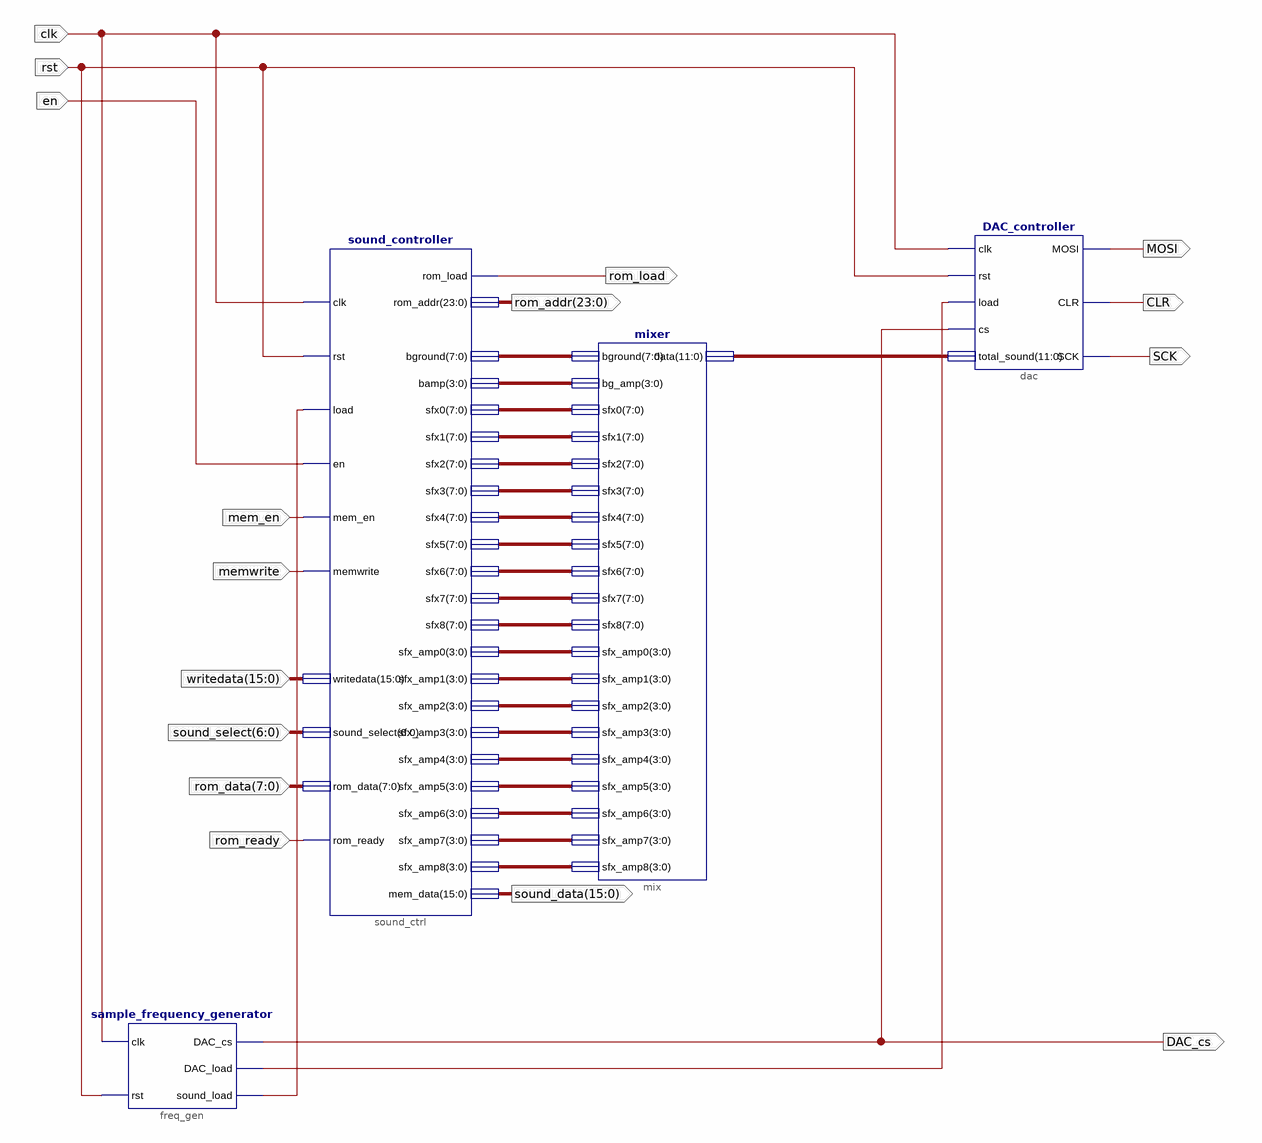
[diagram p0: schematic sheet 1]
// Xilinx ISE schematic sound_schematic.sch (spartan3e) as structural Verilog: 4 symbols, 16 ports
module sound_schematic (
  input  [15:0] writedata,
  input  [6:0] sound_select,
  input  mem_en,
  input  memwrite,
  input  rst,
  input  en,
  input  clk,
  input  [7:0] rom_data,
  input  rom_ready,
  output MOSI,
  output SCK,
  output DAC_cs,
  output [15:0] sound_data,
  output rom_load,
  output [23:0] rom_addr,
  output CLR
);

  wire XLXN_149, XLXN_150;
  wire [3:0] XLXN_2, XLXN_12, XLXN_13, XLXN_14, XLXN_15, XLXN_16, XLXN_17, XLXN_18, XLXN_19, XLXN_20;
  wire [7:0] XLXN_1, XLXN_3, XLXN_4, XLXN_5, XLXN_6, XLXN_7, XLXN_8, XLXN_9, XLXN_10, XLXN_11;
  wire [11:0] XLXN_21;

  sound_controller sound_ctrl (
    .clk(clk), .rst(rst), .load(XLXN_149), .en(en), .mem_en(mem_en), .memwrite(memwrite),
    .writedata(writedata), .sound_select(sound_select), .rom_data(rom_data), .bground(XLXN_1), .bamp(XLXN_2),
    .sfx0(XLXN_3), .sfx1(XLXN_4), .sfx2(XLXN_5), .sfx3(XLXN_6), .sfx4(XLXN_7), .sfx5(XLXN_8), .sfx6(XLXN_9),
    .sfx7(XLXN_10), .sfx8(XLXN_11), .sfx_amp0(XLXN_12), .sfx_amp1(XLXN_13), .sfx_amp2(XLXN_14),
    .sfx_amp3(XLXN_15), .sfx_amp4(XLXN_16), .sfx_amp5(XLXN_17), .sfx_amp6(XLXN_18), .sfx_amp7(XLXN_19),
    .sfx_amp8(XLXN_20), .rom_load(rom_load), .rom_addr(rom_addr), .rom_ready(rom_ready), .mem_data(sound_data));
  mixer mix (
    .bground(XLXN_1), .bg_amp(XLXN_2), .sfx0(XLXN_3), .sfx1(XLXN_4), .sfx2(XLXN_5), .sfx3(XLXN_6),
    .sfx4(XLXN_7), .sfx5(XLXN_8), .sfx6(XLXN_9), .sfx7(XLXN_10), .sfx8(XLXN_11), .sfx_amp0(XLXN_12),
    .sfx_amp1(XLXN_13), .sfx_amp2(XLXN_14), .sfx_amp3(XLXN_15), .sfx_amp4(XLXN_16), .sfx_amp5(XLXN_17),
    .sfx_amp6(XLXN_18), .sfx_amp7(XLXN_19), .sfx_amp8(XLXN_20), .data(XLXN_21));
  DAC_controller dac (
    .clk(clk), .rst(rst), .load(XLXN_150), .cs(DAC_cs), .total_sound(XLXN_21), .MOSI(MOSI), .SCK(SCK),
    .CLR(CLR));
  sample_frequency_generator freq_gen (
    .rst(rst), .DAC_cs(DAC_cs), .DAC_load(XLXN_150), .sound_load(XLXN_149), .clk(clk));
endmodule
